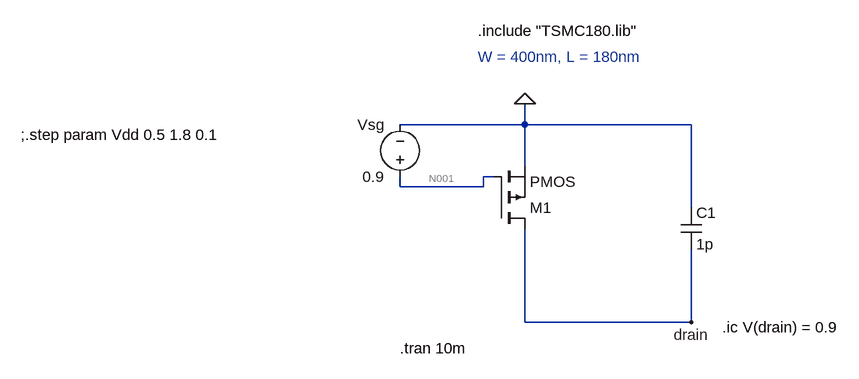
[diagram p0: schematic Q1_pmos_400_180.asc]
Q1_pmos_400_180.asc, the LTspice schematic file:
Version 4
SHEET 1 880 680
WIRE 112 48 112 16
WIRE 112 48 -80 48
WIRE 368 48 112 48
WIRE 112 112 112 48
WIRE 64 128 48 128
WIRE -80 144 -80 128
WIRE 48 144 48 128
WIRE 48 144 -80 144
WIRE 368 176 368 48
WIRE 112 352 112 208
WIRE 368 352 368 240
WIRE 368 352 112 352
FLAG 368 352 drain
FLAG 112 16 0
SYMBOL cap 352 176 R0
SYMATTR InstName C1
SYMATTR Value 1p
SYMBOL pmos 64 208 M180
SYMATTR InstName M1
SYMBOL voltage -80 144 R180
WINDOW 0 24 96 Left 2
WINDOW 3 24 16 Left 2
SYMATTR InstName Vsg
SYMATTR Value 0.9
TEXT 40 -96 Left 2 !.include "TSMC180.lib"
TEXT 40 -56 Left 2 ;W = 400nm, L = 180nm
TEXT 416 360 Left 2 !.ic V(drain) = 0.9
TEXT -80 392 Left 2 !.tran 10m
TEXT -664 64 Left 2 !;.step param Vdd 0.5 1.8 0.1

The netlist it stands for:
* Q1_pmos_400_180.asc
C1 0 drain 1p
M1 drain N001 0 0 PMOS
Vsg N001 0 0.9
.model NMOS NMOS
.model PMOS PMOS
.lib standard.mos
.include "TSMC180.lib"
* W = 400nm, L = 180nm
.ic V(drain) = 0.9
.tran 10m
;.step param Vdd 0.5 1.8 0.1
.backanno
.end

* Results of the author's LTspice run, read from the files saved beside the schematic
* Operating Point, zero values left out:
*   V(drain) = 900 mV
*   V(n001) = 900 mV
*   Id(M1) = 12.93 A
*   Ib(M1) = -12.93 A
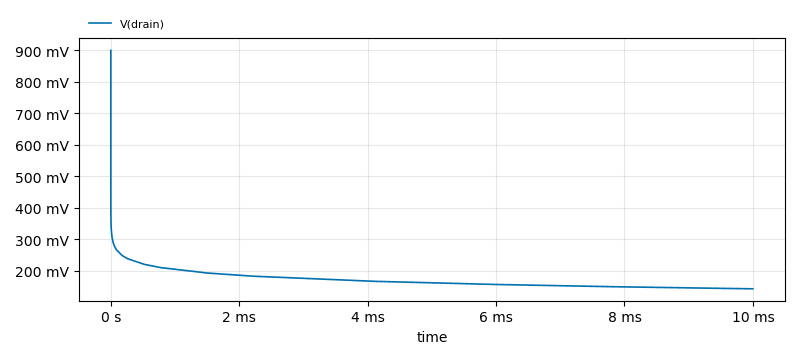
[diagram p1: Transient Analysis of Q1_pmos_400_180.asc, plotted from the saved traces]
* Transient Analysis, 1 run:
*   V(drain): min 142.2 mV, max 900 mV, average 169.1 mV, rms 171.2 mV, last 142.2 mV